# Altium schematic sheet Main.SchDoc
size A4; SheetNumber: 1; SheetTotal: 11
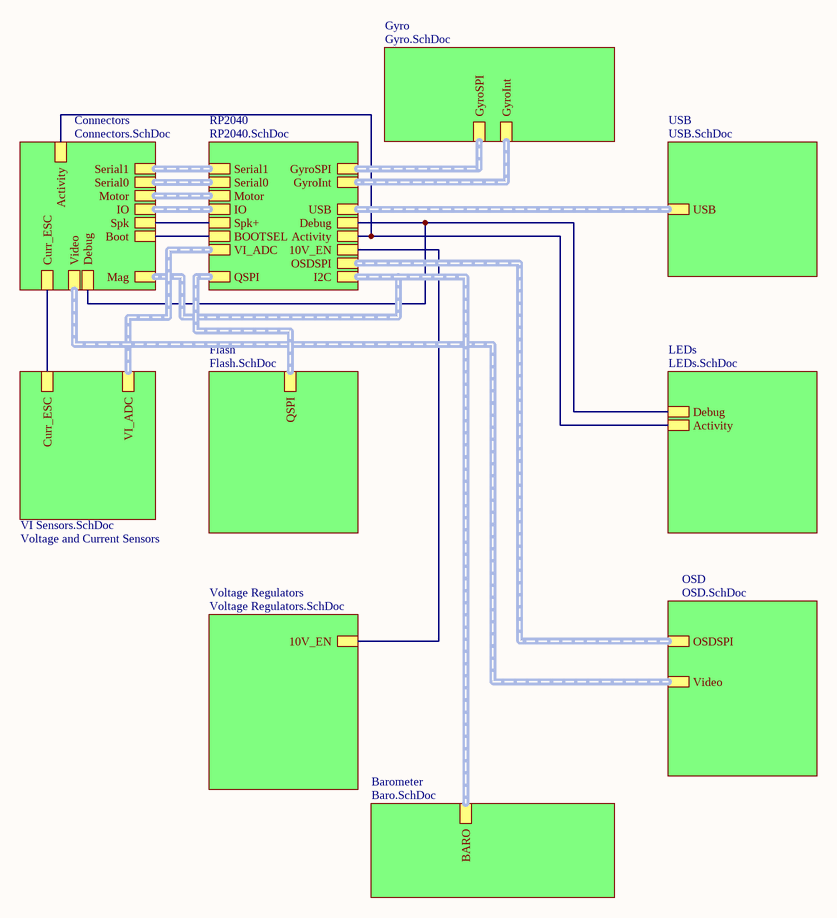
[diagram p0: Main.SchDoc]

## Sub-sheets
Barometer = Baro.SchDoc: BARO
Connectors = Connectors.SchDoc: Serial1, Motor, Mag, Serial0, Curr_ESC, IO, Video, Spk, Debug, Activity, Boot
Flash = Flash.SchDoc: QSPI
Gyro = Gyro.SchDoc: GyroSPI, GyroInt
LEDs = LEDs.SchDoc: Debug, Activity
OSD = OSD.SchDoc: OSDSPI, Video
RP2040 = RP2040.SchDoc: QSPI, USB, Debug, Activity, I2C, OSDSPI, GyroSPI, GyroInt, Serial1, Motor, Serial0, VI_ADC, IO, Spk+, 10V_EN, BOOTSEL
USB = USB.SchDoc: USB
Voltage and Current Sensors = VI Sensors.SchDoc: Curr_ESC, VI_ADC
Voltage Regulators = Voltage Regulators.SchDoc: 10V_EN

## Nets
(unnamed): sheet RP2040/Debug, sheet LEDs/Debug, sheet Connectors/Debug
(unnamed): sheet RP2040/Activity, sheet LEDs/Activity, sheet Connectors/Activity
(unnamed): sheet RP2040/Spk+, sheet Connectors/Spk
(unnamed): sheet RP2040/10V_EN, sheet Voltage Regulators/10V_EN
(unnamed): sheet RP2040/BOOTSEL, sheet Connectors/Boot
(unnamed): sheet Connectors/Curr_ESC, sheet Voltage and Current Sensors/Curr_ESC

## Buses and harness runs
harness sheet Barometer/BARO = sheet Connectors/Mag = sheet RP2040/I2C
harness sheet Connectors/IO = sheet RP2040/IO
harness sheet Connectors/Motor = sheet RP2040/Motor
harness sheet Connectors/Serial0 = sheet RP2040/Serial0
harness sheet Connectors/Serial1 = sheet RP2040/Serial1
harness sheet Connectors/Video = sheet OSD/Video
harness sheet Flash/QSPI = sheet RP2040/QSPI
harness sheet Gyro/GyroInt = sheet RP2040/GyroInt
harness sheet Gyro/GyroSPI = sheet RP2040/GyroSPI
harness sheet OSD/OSDSPI = sheet RP2040/OSDSPI
harness sheet RP2040/USB = sheet USB/USB
harness sheet RP2040/VI_ADC = sheet Voltage and Current Sensors/VI_ADC